# EAGLE design Arm (EAGLE 9.1.3)
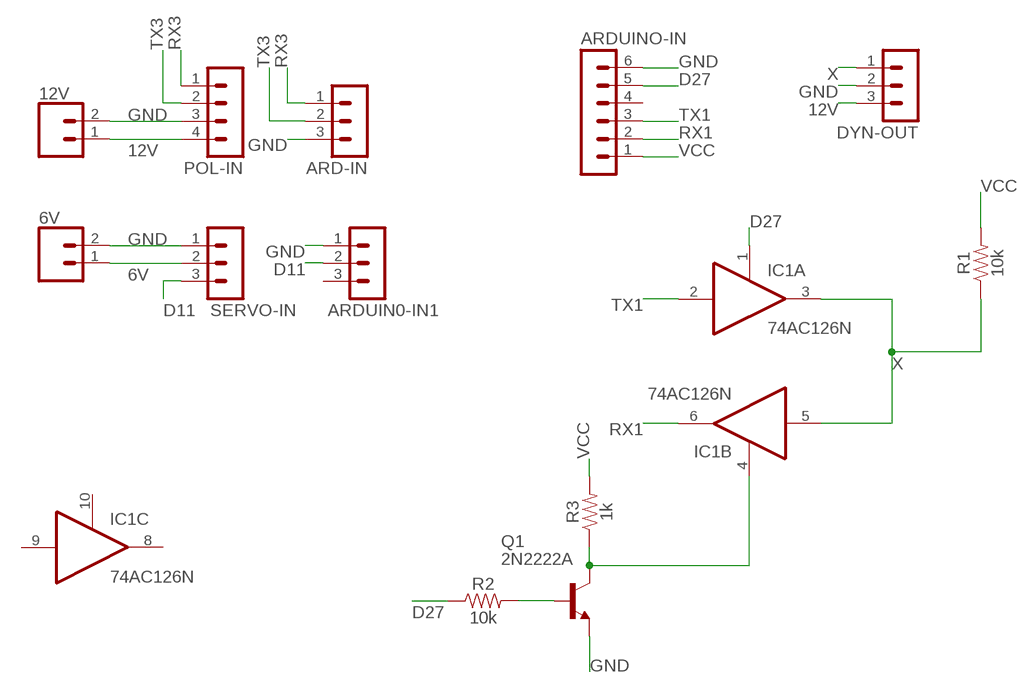
[diagram p0: schematic, sheet 1]

## Parts
6V  CONN_021X02_NO_SILK  [1X02_NO_SILK]
12V  CONN_021X02_NO_SILK  [1X02_NO_SILK]
ARD-IN  MA03-1  [MA03-1]
ARDUIN0-IN1  MA03-1  [MA03-1]
ARDUINO-IN  MA06-1  [MA06-1]
DYN-OUT  MA03-1  [MA03-1]
IC1  74AC126N  [DIL14]
POL-IN  MA04-1  [MA04-1]
Q1  2N2222A  [TO18]
R1  10k  1KOHM-HORIZ-1/4W-1%  [AXIAL-0.3]
R2  10k  1KOHM-HORIZ-1/4W-1%  [AXIAL-0.3]
R3  1k  1KOHM-HORIZ-1/4W-1%  [AXIAL-0.3]
SERVO-IN  MA03-1  [MA03-1]

## Nets
6V: 6V.1 SERVO-IN.2
12V: 12V.1 DYN-OUT.3 POL-IN.4
D11: ARDUIN0-IN1.2 SERVO-IN.3
D27: ARDUINO-IN.5 IC1.1(A:OE) R2.P$1
GND: 6V.2 12V.2 ARD-IN.3 ARDUIN0-IN1.1 ARDUINO-IN.6 DYN-OUT.2 POL-IN.3 Q1.1(E) SERVO-IN.1
N$4: IC1.4(B:OE) Q1.3(C) R3.P$1
N$5: Q1.2(B) R2.P$2
RX1: ARDUINO-IN.2 IC1.6(B:O)
RX3: ARD-IN.1 POL-IN.1
TX1: ARDUINO-IN.3 IC1.2(A:I)
TX3: ARD-IN.2 POL-IN.2
VCC: ARDUINO-IN.1 R1.P$2 R3.P$2
X: DYN-OUT.1 IC1.3(A:O) IC1.5(B:I) R1.P$1
Unconnected: ARDUIN0-IN1.3 ARDUINO-IN.4 IC1.8(C:O) IC1.9(C:I) IC1.10(C:OE) IC1.11(D:O) IC1.12(D:I) IC1.13(D:OE)

## Power pins joined to a net without a drawn wire
GND: IC1.7(P:GND)
VCC: IC1.14(P:VCC)

## Library data of the parts
6V 12V = SparkFun-Connectors:CONN_02: Multi connection point. Often used as Generic Header-pin footprint for 0.1 inch spaced/style header connections On any of the 0.1 inch spaced packages, you can populate with these: Break Away Headers - Straight <https://www.sparkfun.com/products/116> (PRT-00116) Break Away Male Headers - Right Angle <https://www.sparkfun.com/products/553> (PRT-00553) Female Headers <https://www.sparkfun.com/products/115> (PRT-00115) Break Away Headers - Machine Pin <https://www.sparkfun.com/products/117> (PRT-00117) Break Away Female Headers - Swiss Machine Pin <https://www.sparkfun.com/products/743> (PRT-00743) For SCREWTERMINALS and SPRING TERMINALS visit here: Screw Terimnals on SparkFun.com <https://www.sparkfun.com/search/results?term=Screw+Terminals> (5mm/3.5mm/2.54mm spacing) This device is also useful as a general connection point to wire up your design to another part of your project. Our various solder wires solder well into these plated through hole pads. Hook-Up Wire - Assortment (Stranded, 22 AWG) <https://www.sparkfun.com/products/11375> (PRT-11375) Hook-Up Wire - Assortment (Solid Core, 22 AWG) <https://www.sparkfun.com/products/11367> (PRT-11367) View the entire wire category on our website here <https://www.sparkfun.com/categories/141> Special notes: Molex polarized connector foot print use with: PRT-08233 with associated crimp pins and housings. 2.54_SCREWTERM for use with PRT-10571. 3.5mm Screw Terminal footprints for PRT-08084 5mm Screw Terminal footprints for use with PRT-08432
ARD-IN ARDUIN0-IN1 DYN-OUT SERVO-IN = con-lstb:MA03-1: PIN HEADER; OC_FARNELL: unknown; OC_NEWARK: unknown
ARDUINO-IN = con-lstb:MA06-1: PIN HEADER; OC_FARNELL: unknown; OC_NEWARK: unknown
IC1 = 74xx-eu:74*126: Quad bus BUFFER, 3-state
POL-IN = con-lstb:MA04-1: PIN HEADER; OC_FARNELL: unknown; OC_NEWARK: unknown
Q1 = transistor-npn:2N2222*: NPN Transistor
R1 R2 = SparkFun-Resistors:1KOHM: 1kΩ resistor A resistor is a passive two-terminal electrical component that implements electrical resistance as a circuit element. Resistors act to reduce current flow, and, at the same time, act to lower voltage levels within circuits. - Wikipedia; PROD_ID: RES-12182; VALUE: 1k
R3 = SparkFun-Resistors:1KOHM: 1kΩ resistor A resistor is a passive two-terminal electrical component that implements electrical resistance as a circuit element. Resistors act to reduce current flow, and, at the same time, act to lower voltage levels within circuits. - Wikipedia; PROD_ID: RES-12182

## Board
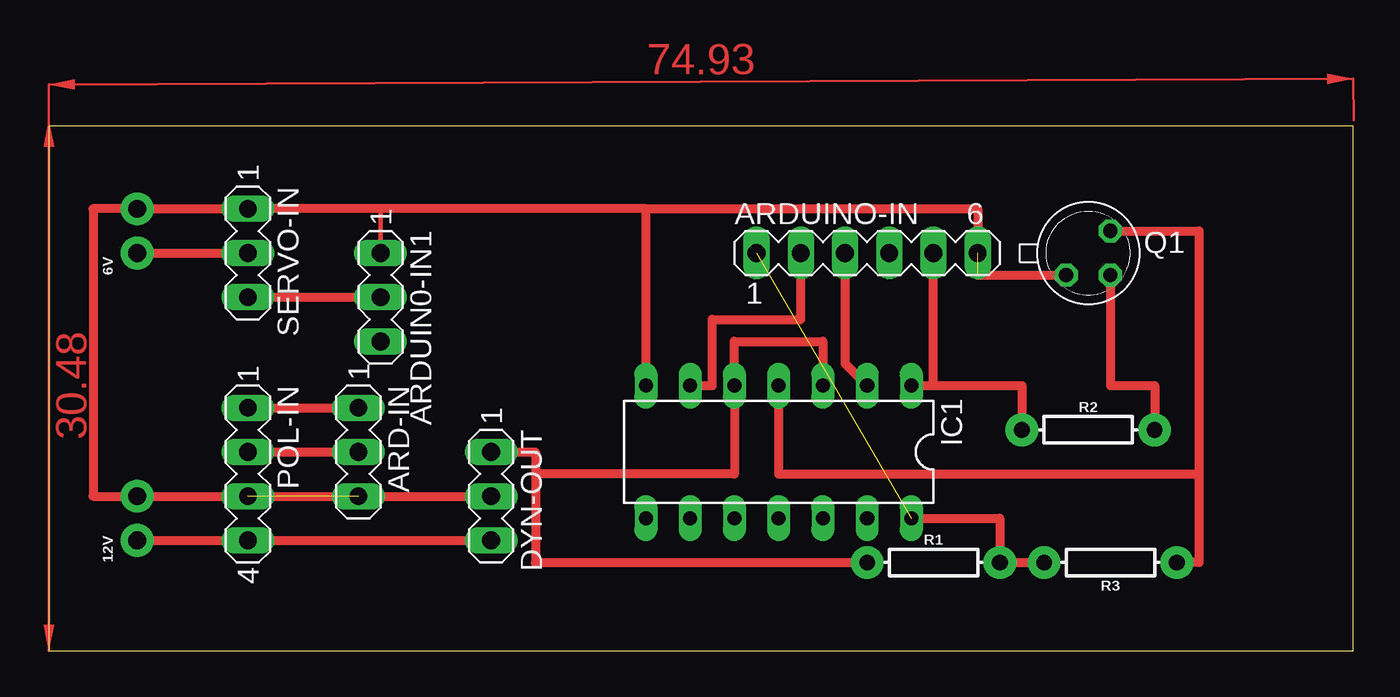
[diagram p1: board, top side]

Size 74.91 x 30.15 mm. Coordinates in mm from the lower left corner, seen from the top.
Outline: 0,0 74.91,0 74.91,30.15 0,30.15 0,0
Copper layers (1*16): Top 0.035mm / dielectric 1.5mm / Bottom 0.035mm
Design rules "default": minimum track width 6mil, minimum drill 0.35mm, track to track 6mil, track to pad 6mil, pad to pad 6mil, via to via 6mil, smd to smd 6mil, copper to edge 40mil, drill to drill 6mil, minimum pad ring 10mil, minimum via ring 8mil, stop-mask expansion 4mil, vias tented up to drill 0mil, thermal gap 10mil

### Footprints (pad centres in the part's own frame; a part is rotated, then mirrored left to right if it is on the bottom)
1X02_NO_SILK = drill 1.016 pad 1.88: 1 0,0; 2 2.54,0
MA03-1 = drill 1.016 long: 1 -2.54,0; 2 0,0; 3 2.54,0
MA06-1 = drill 1.016 long: 1 -6.35,0; 2 -3.81,0; 3 -1.27,0; 4 1.27,0; 5 3.81,0; 6 6.35,0
DIL14 = drill 0.813 long: 1 -7.62,-3.81; 2 -5.08,-3.81; 3 -2.54,-3.81; 4 0,-3.81; 5 2.54,-3.81; 6 5.08,-3.81; 7 7.62,-3.81; 8 7.62,3.81; 9 5.08,3.81; 10 2.54,3.81; 11 0,3.81; 12 -2.54,3.81; 13 -5.08,3.81; 14 -7.62,3.81
MA04-1 = drill 1.016 long: 1 -3.81,0; 2 -1.27,0; 3 1.27,0; 4 3.81,0
TO18 = drill 0.813 octagon: 1 -1.27,-1.27; 2 1.27,-1.27; 3 1.27,1.27
AXIAL-0.3 = drill 0.9 pad 1.88: P$1 -3.81,0; P$2 3.81,0

### Placement (x,y rotation side)
6V  5.08,22.86 90 top
12V  5.08,6.35 90 top
ARD-IN  17.78,11.43 270 top
ARDUIN0-IN1  19.05,20.32 270 top
ARDUINO-IN  46.99,22.86 0 top
DYN-OUT  25.4,8.89 270 top
IC1  41.91,11.43 180 top
POL-IN  11.43,10.16 270 top
Q1  59.69,22.86 0 top
R1  50.8,5.08 0 top
R2  59.69,12.7 0 top
R3  60.96,5.08 180 top
SERVO-IN  11.43,22.86 270 top

### Tracks (layer width: path | path; a pad name or v marks a point on that pad's centre or on a via)
6V
  Top 0.508: 6V.1 SERVO-IN.2
12V
  Top 0.508: 12V.1 POL-IN.4 DYN-OUT.3
D11
  Top 0.508: SERVO-IN.3 ARDUIN0-IN1.2
D27
  Top 0.508: 50.8,15.24 ARDUINO-IN.5 | 50.8,15.24 55.88,15.24 R2.P$1 | IC1.1 50.8,15.24
GND  (2 unrouted)
  Top 0.254: ARDUIN0-IN1.1 19.05,25.4
  Top 0.508: DYN-OUT.2 POL-IN.3 12V.2 2.54,8.89 2.54,25.4 6V.2 SERVO-IN.1 | 12.7,25.4 SERVO-IN.1 | 34.29,25.4 53.34,25.4 53.34,21.59 Q1.1 | 34.29,25.4 19.05,25.4 SERVO-IN.1 | IC1.7 34.29,25.4
N$4
  Top 0.508: Q1.3 66.04,24.13 66.04,10.16 | 66.04,10.16 66.04,5.08 R3.P$1 | IC1.4 41.91,10.16 66.04,10.16
N$5
  Top 0.508: Q1.2 60.96,15.24 63.5,15.24 R2.P$2
RX1
  Top 0.508: IC1.6 38.1,15.24 38.1,19.05 43.18,19.05 ARDUINO-IN.2
RX3
  Top 0.508: POL-IN.1 ARD-IN.1
TX1
  Top 0.508: ARDUINO-IN.3 45.72,16.51 IC1.2
TX3
  Top 0.508: POL-IN.2 ARD-IN.2
VCC  (1 unrouted)
  Top 0.508: R3.P$2 R1.P$2 54.61,7.62 IC1.14
X
  Top 0.508: DYN-OUT.1 27.94,11.43 27.94,10.16 | 27.94,10.16 27.94,5.08 R1.P$1 | 27.94,10.16 39.37,10.16 IC1.5 39.37,17.78 44.45,17.78 IC1.3
(copper drawn outside any net)
  shapes: Top area x2